# EAGLE design test#2 (EAGLE 9.6.2)
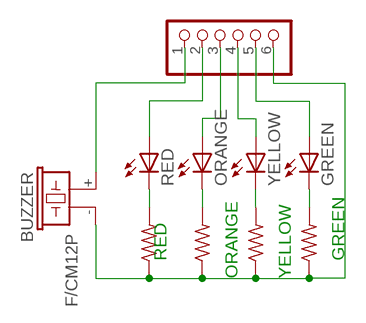
[diagram p0: schematic, sheet 1]

## Parts
BUZZER  F/CM12P  [F/CM12P]
GND  PINHD-1X6  [1X06]
GREEN  LED5MM  [LED5MM]
ORANGE  LED5MM  [LED5MM]
R1  R-US_0204/7  [0204/7]
R2  R-US_0204/7  [0204/7]
R3  R-US_0204/7  [0204/7]
R4  R-US_0204/7  [0204/7]
RED  LED5MM  [LED5MM]
YELLOW  LED5MM  [LED5MM]

## Nets
N$1: R1.2 RED.K(C)
N$2: ORANGE.K(C) R2.2
N$3: R3.2 YELLOW.K(C)
N$4: GREEN.K(C) R4.2
N$5: BUZZER.+ GND.1
N$6: GND.2 RED.A
N$7: GND.3 ORANGE.A
N$8: GND.4 YELLOW.A
N$9: GND.5 GREEN.A
N$11: BUZZER.- GND.6 R1.1 R2.1 R3.1 R4.1

## Notes on the sheet
- RED | GREEN
- ORANGE | YELLOW

## Library data of the parts
BUZZER = buzzer:F/CM12P: BUZZER Source: Buerklin; OC_FARNELL: unknown; OC_NEWARK: unknown
GND = pinhead:PINHD-1X6: PIN HEADER
GREEN ORANGE RED YELLOW = adafruit:LED: LED OSRAM: - CHIPLED LG R971, LG N971, LY N971, LG Q971, LY Q971, LO R971, LY R971 LH N974, LH R974 LS Q976, LO Q976, LY Q976 LO Q996 - Hyper CHIPLED LW Q18S LB Q993, LB Q99A, LB R99A - SideLED LS A670, LO A670, LY A670, LG A670, LP A670 LB A673, LV A673, LT A673, LW A673 LH A674 LY A675 LS A676, LA A676, LO A676, LY A676, LW A676 LS A679, LY A679, LG A679 - Hyper Micro SIDELED® LS Y876, LA Y876, LO Y876, LY Y876 LT Y87S - SmartLED LW L88C, LW L88S LB L89C, LB L89S, LG L890 LS L89K, LO L89K, LY L89K LS L896, LA L896, LO L896, LY L896 - TOPLED LS T670, LO T670, LY T670, LG T670, LP T670 LSG T670, LSP T670, LSY T670, LOP T670, LYG T670 LG T671, LOG T671, LSG T671 LB T673, LV T673, LT T673, LW T673 LH T674 LS T676, LA T676, LO T676, LY T676, LB T676, LH T676, LSB T676, LW T676 LB T67C, LV T67C, LT T67C, LS T67K, LO T67K, LY T67K, LW E67C LS E67B, LA E67B, LO E67B, LY E67B, LB E67C, LV E67C, LT E67C LW T67C LS T679, LY T679, LG T679 LS T770, LO T770, LY T770, LG T770, LP T770 LB T773, LV T773, LT T773, LW T773 LH T774 LS E675, LA E675, LY E675, LS T675 LS T776, LA T776, LO T776, LY T776, LB T776 LHGB T686 LT T68C, LB T68C - Hyper Mini TOPLED® LB M676 - Mini TOPLED Santana® LG M470 LS M47K, LO M47K, LY M47K Source: http://www.osram.convergy.de/
R1-R4 = rcl:R-US_: RESISTOR, American symbol; SPICEPREFIX: R

## Board
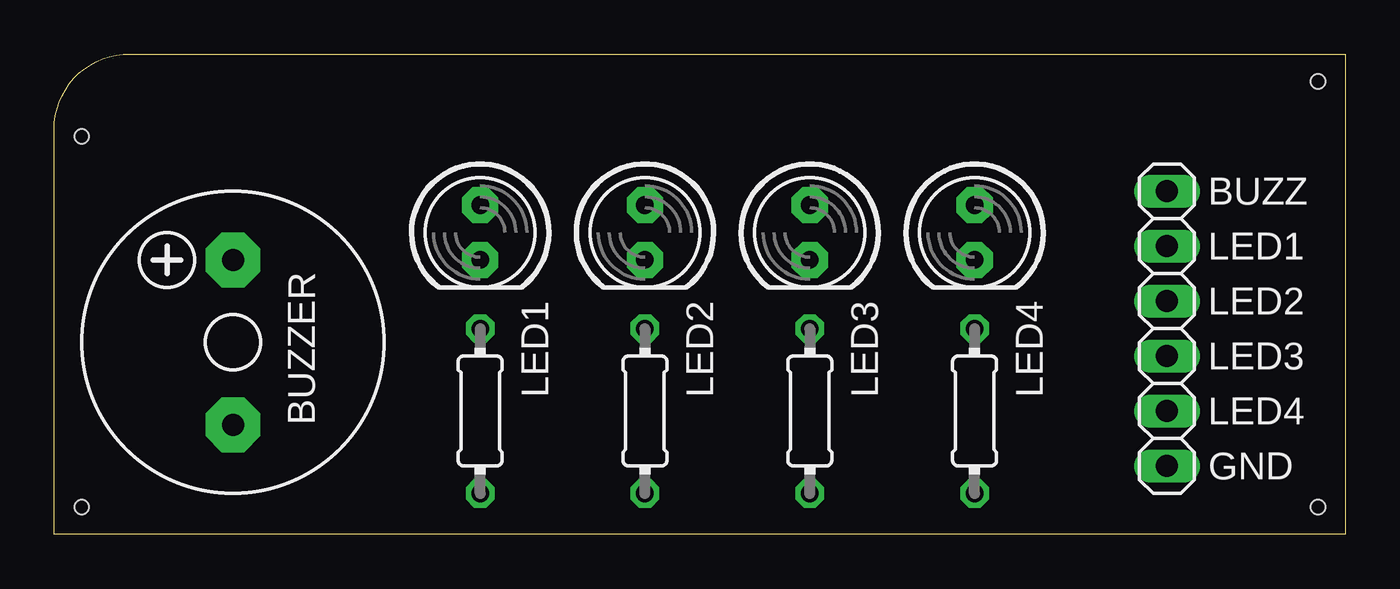
[diagram p1: board, top side]
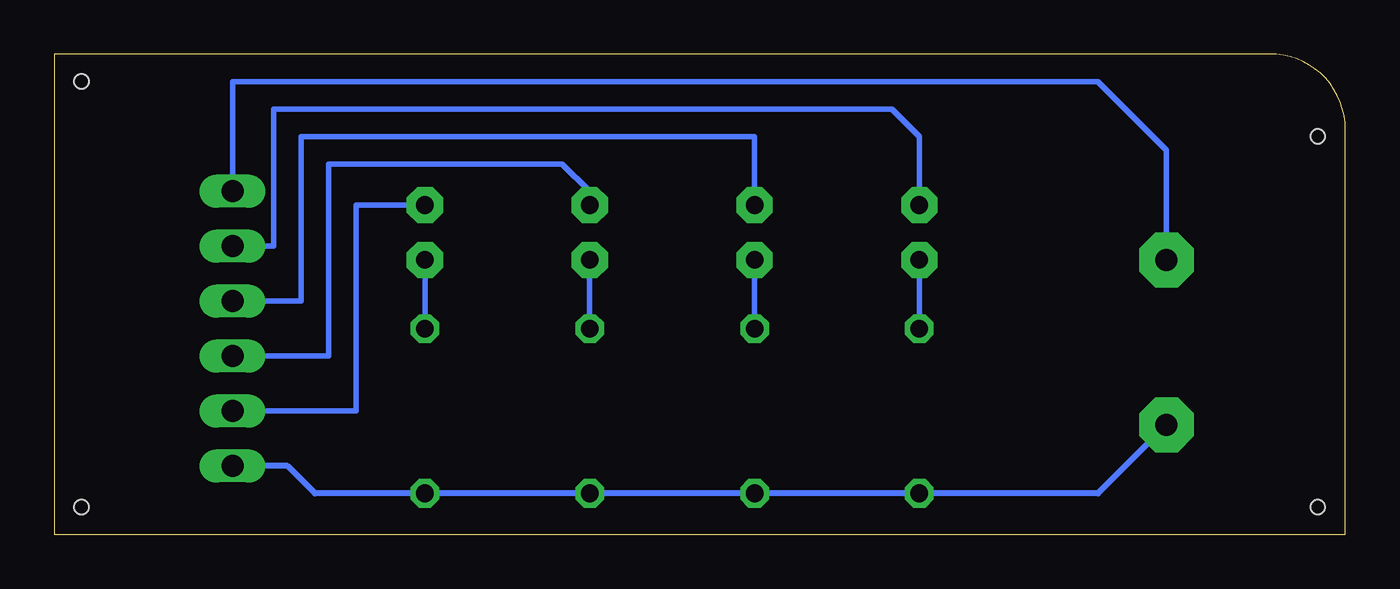
[diagram p2: board, bottom side, seen from below]

Size 59.7 x 22.23 mm. Coordinates in mm from the lower left corner, seen from the top.
Outline: 59.7,0 0.01,0 0.01,18.41 arc-90 3.19,22.23 59.7,22.23 59.7,0
Copper layers (1*16): Top 0.035mm / dielectric 1.5mm / Bottom 0.035mm
Design rules "default": minimum track width 6mil, minimum drill 0.35mm, track to track 6mil, track to pad 6mil, pad to pad 6mil, via to via 6mil, smd to smd 6mil, copper to edge 40mil, drill to drill 6mil, minimum pad ring 10mil, minimum via ring 8mil, stop-mask expansion 4mil, vias tented up to drill 0mil, thermal gap 10mil
Holes 0.65 mm at 1.28,18.41 1.28,1.27 58.43,20.95 58.43,1.27

### Footprints (pad centres in the part's own frame; a part is rotated, then mirrored left to right if it is on the bottom)
F/CM12P = drill 1.016 pad 2.54 octagon: + 3.81,0; - -3.81,0
1X06 = drill 1.016 long: 1 -6.35,0; 2 -3.81,0; 3 -1.27,0; 4 1.27,0; 5 3.81,0; 6 6.35,0
LED5MM = drill 0.813 pad 1.676 octagon: A -1.27,0; K 1.27,0
0204/7 = drill 0.813 octagon: 1 -3.81,0; 2 3.81,0

### Placement (x,y rotation side)
BUZZER  8.27,8.89 90 top
GND  51.45,9.53 270 top
GREEN  42.56,13.97 270 top
ORANGE  27.32,13.97 270 top
R1  19.7,5.71 90 top
R2  27.32,5.71 90 top
R3  34.94,5.71 90 top
R4  42.56,5.71 90 top
RED  19.7,13.97 270 top
YELLOW  34.94,13.97 270 top

### Tracks (layer width: path | path; a pad name or v marks a point on that pad's centre or on a via)
N$1
  Bottom 0.254: R1.2 RED.K
N$2
  Bottom 0.254: R2.2 ORANGE.K
N$3
  Bottom 0.152: R3.2 35.04,9.58 | 35.04,12.6 YELLOW.K
  Bottom 0.254: R3.2 YELLOW.K
N$4
  Top 0.152: 42.66,9.58 R4.2
  Bottom 0.254: R4.2 GREEN.K
N$5
  Bottom 0.254: BUZZER.+ 8.27,17.78 11.44,20.95 51.45,20.95 GND.1
N$6
  Bottom 0.254: RED.A 19.7,18.41 20.97,19.68 49.54,19.68 49.54,13.34 GND.2
N$7
  Bottom 0.254: GND.3 48.27,10.79 48.27,18.41 27.32,18.41 ORANGE.A
N$8
  Bottom 0.254: YELLOW.A 34.94,15.88 36.21,17.14 47,17.14 47,8.26 GND.4
N$9
  Bottom 0.254: GREEN.A 45.73,15.24 45.73,5.71 GND.5
N$11
  Bottom 0.28: BUZZER.- 11.44,1.91 R1.1 R2.1 R3.1 R4.1 47.64,1.91 48.91,3.17 GND.6

### Text on the board
tNames: LED1 | LED2 | LED3 | LED4 | BUZZER | BUZZ / LED1 / LED2 / LED3 / LED4 / GND